# Altium project MINI-STM32.PRJPCB
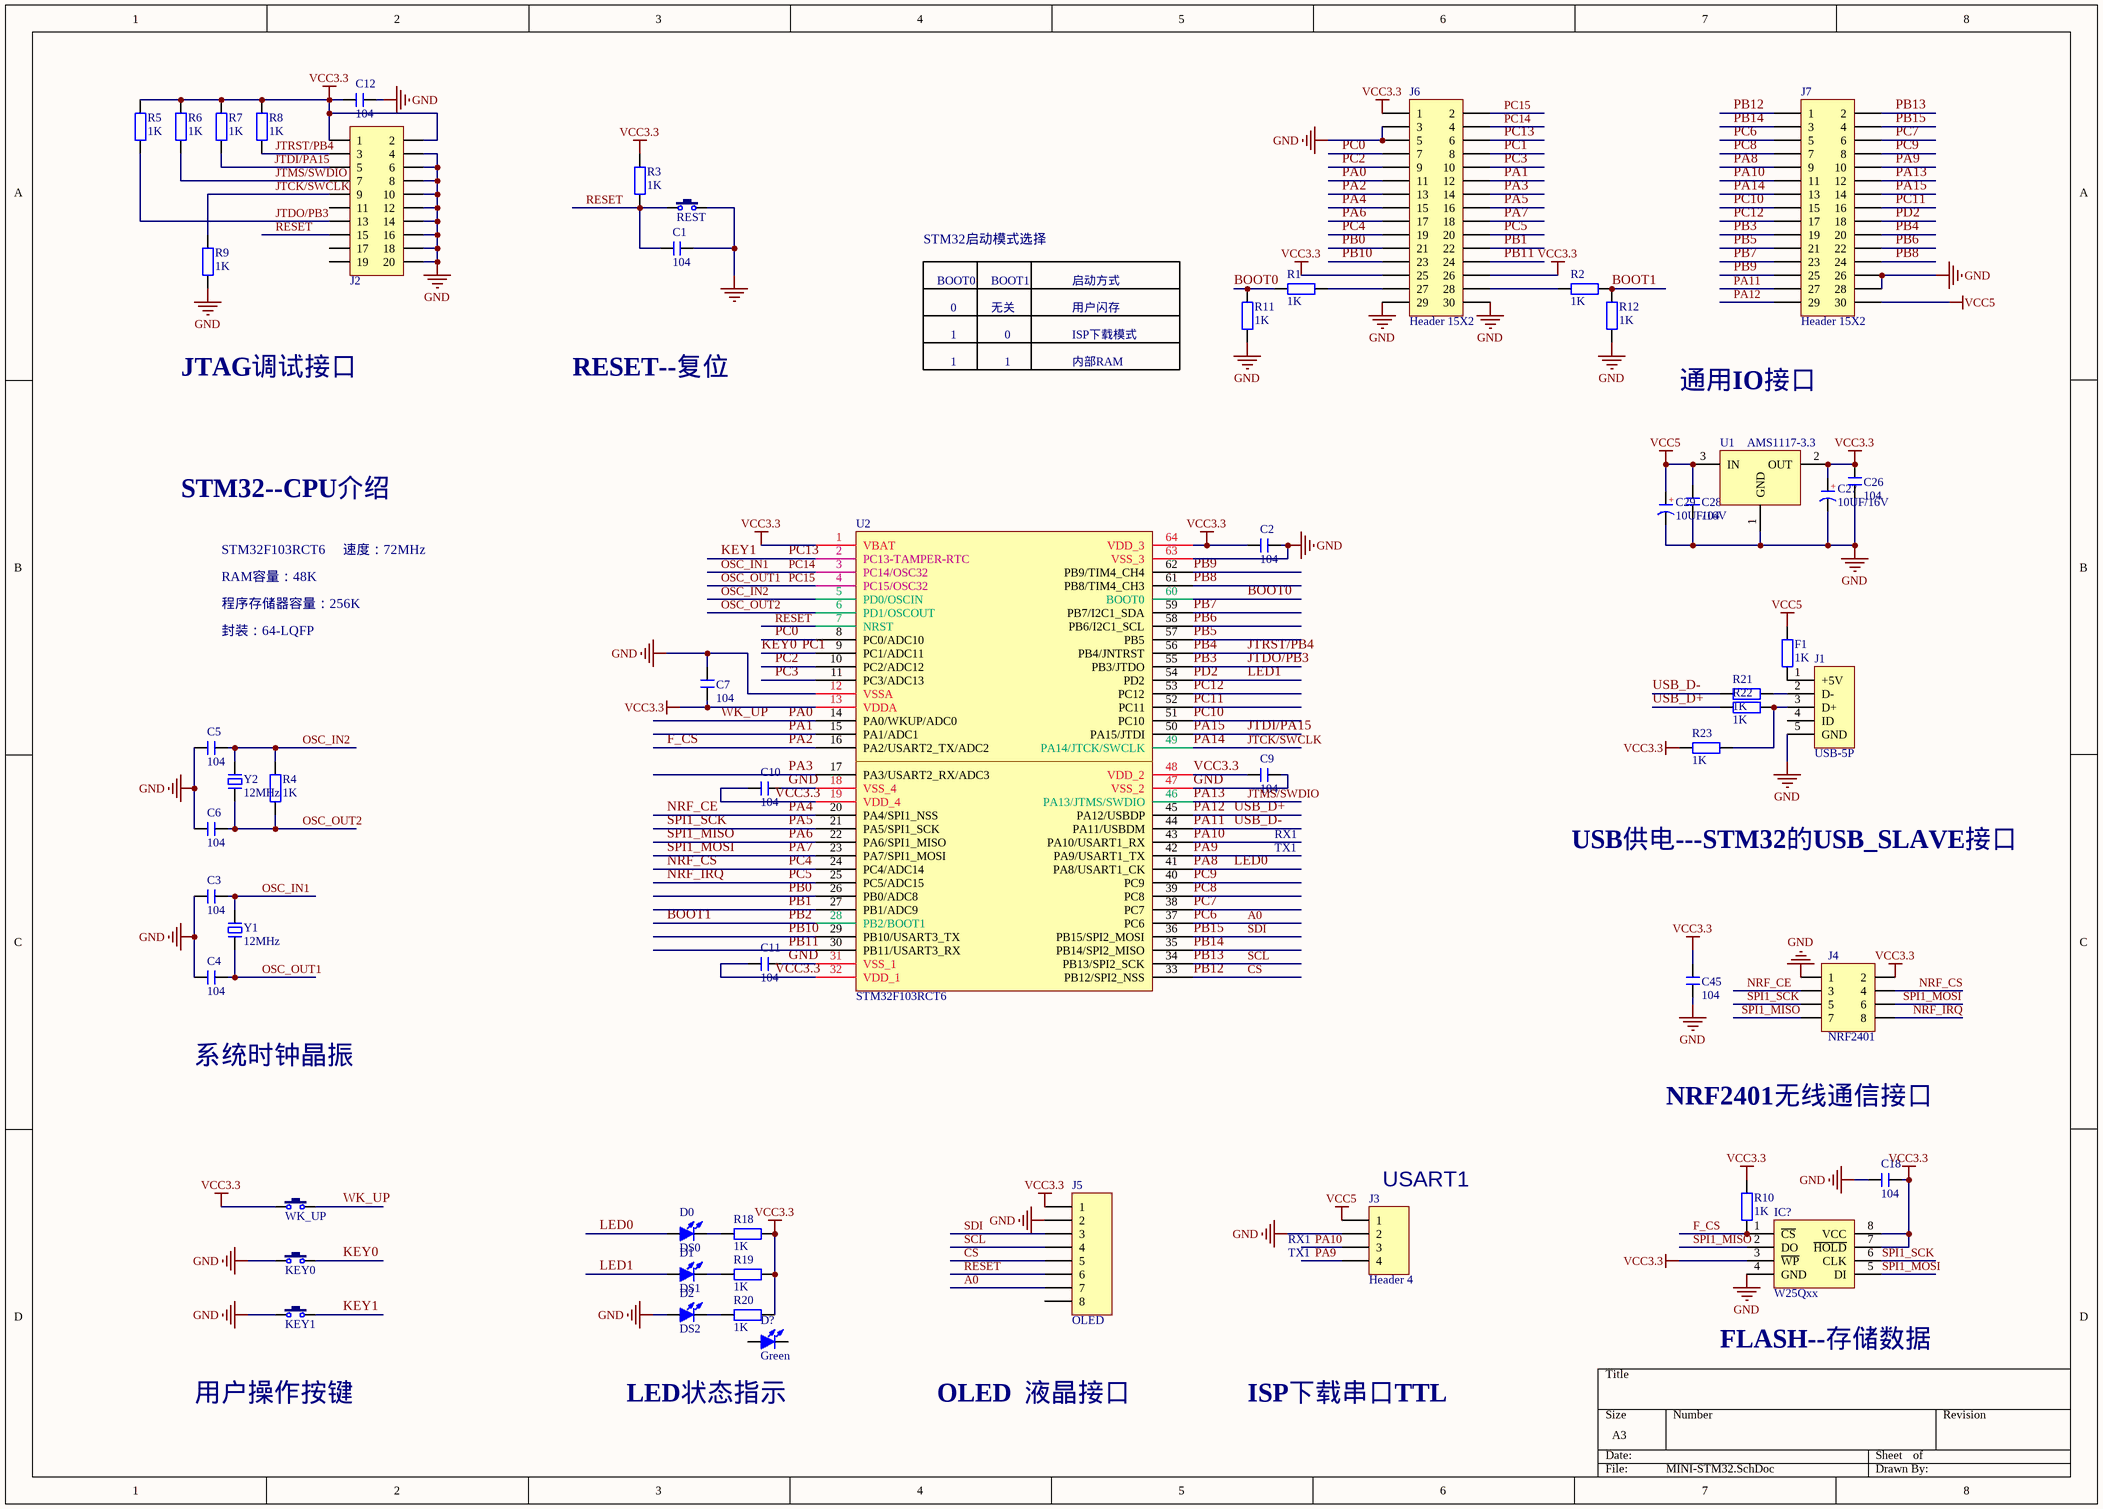
[diagram p0: MINI-STM32.SchDoc]
1 sheet, 56 parts. Net scope: global (net labels, ports and power ports of the same name join across sheets).
Board file: MINI-STM32.PcbDoc

## Sheet MINI-STM32.SchDoc
size A3

### Parts
C1  104  [C 0603]
C2  104  [C 0603]
C3  104  [C 0603]
C4  104  [C 0603]
C5  104  [C 0603]
C6  104  [C 0603]
C7  104  [C 0603]
C9  104  [C 0603]
C10  104  [C 0603]
C11  104  [C 0603]
C12  104  [C 0603]
C18  104  [C 0603]
C26  104  [C 0805]
C27  10UF/16V  [C 0805]
C28  104  [C 0603]
C29  10UF/16V  [C 0805]
C45  104  [C 0603]
D0  DS0  [LED 0805G]
D1  DS1  [LED 0805G]
D2  DS2  [LED 0805G]
D?  Green  [LED 0805G]
F1  1K  [R 0805]
IC?  W25Qxx  [SOP8W_N]
J1  USB-5P  [USB-MICRO_A]
J2  Header 2X10  [HDR-10X2]  (value not drawn)
J3  Header 4  [HDR-1X4]
J4  NRF2401  [HDR-4X2]
J5  OLED  [HDR-1X8_M]
J6  Header 15X2  [HDR-15X2]
J7  Header 15X2  [HDR-15X2]
KEY0  3x6x5  [TSW SMD-3*6*2.5]  (value not drawn)
KEY1  3x6x5  [TSW SMD-3*6*2.5]  (value not drawn)
R1  1K  [R 0603]
R2  1K  [R 0603]
R3  1K  [R 0603]
R4  1K  [R 0603]
R5  1K  [R 0603]
R6  1K  [R 0603]
R7  1K  [R 0603]
R8  1K  [R 0603]
R9  1K  [R 0603]
R10  1K  [R 0603]
R11  1K  [R 0603]
R12  1K  [R 0603]
R18  1K  [R 0603]
R19  1K  [R 0603]
R20  1K  [R 0603]
R21  1K  [R 0603]
R22  1K  [R 0603]
R23  1K  [R 0603]
REST  3x6x5  [TSW SMD-3*6*2.5]  (value not drawn)
U1  AMS1117-3.3  [SOT223_L]
U2  STM32F103RCT6  [LQFP64 7x7_L]
WK_UP  3x6x5  [TSW SMD-3*6*2.5]  (value not drawn)
Y1  12MHz  [XTAL-49S DIP]
Y2  12MHz  [XTAL-3X10]

### Nets
GND: C1.1 C2.2 C3.1 C4.1 C5.1 C6.1 C7.1 C9.2 C10.2 C11.2 C12.2 C18.1 C26.2 C27.2(K) C28.1 C29.2(K) C45.2 D2.1(A) IC?.4(GND) J1.5(GND) J2.4 J2.6 J2.8 J2.10 J2.12 J2.14 J2.16 J2.18 J2.20 J3.2 J4.1 J5.2 J6.3 J6.5 J6.29 J6.30 J7.26 J7.28 KEY0.1 KEY1.1 R9.1 R11.2 R12.2 REST.2 U1.1(GND) U2.12(VSSA) U2.18(VSS_4) U2.31(VSS_1) U2.47(VSS_2) U2.63(VSS_3)
VCC3.3: C2.1 C7.2 C9.1 C10.1 C11.1 C12.1 C18.2 C26.1 C27.1(A) C45.1 IC?.3(~{WP}) IC?.7(~{HOLD}) IC?.8(VCC) J2.1 J2.2 J4.2 J5.1 J6.1 J6.25 J6.26 R3.2 R5.2 R6.2 R7.2 R8.2 R10.1 R18.1 R19.1 R20.1 R23.2 U1.2(OUT) U2.1(VBAT) U2.13(VDDA) U2.19(VDD_4) U2.32(VDD_1) U2.48(VDD_2) U2.64(VDD_3) WK_UP.1
VCC5: C28.2 C29.1(A) F1.1 J3.1 J7.30 U1.3(IN)
A0: J5.7 J7.5 U2.37(PC6)  [also labelled PC6]
BOOT0: R1.2 R11.1 U2.60(BOOT0)
BOOT1: R2.1 R12.1 U2.28(PB2/BOOT1)  [also labelled PB2]
CS: J5.5 J7.1 U2.33(PB12/SPI2_NSS)  [also labelled PB12]
F_CS: IC?.1(~{CS}) J6.13 R10.2 U2.16(PA2/USART2_TX/ADC2)  [also labelled PA2]
JTCK/SWCLK: J2.9 J7.13 R9.2 U2.49(PA14/JTCK/SWCLK)  [also labelled PA14]
JTDI/PA15: J2.5 J7.14 R7.1 U2.50(PA15/JTDI)  [also labelled PA15]
JTDO/PB3: J2.13 J7.19 R5.1 U2.55(PB3/JTDO)  [also labelled PB3]
JTMS/SWDIO: J2.7 J7.12 R6.1 U2.46(PA13/JTMS/SWDIO)  [also labelled PA13]
JTRST/PB4: J2.3 J7.20 R8.1 U2.56(PB4/JNTRST)  [also labelled PB4]
KEY0: J6.8 KEY0.2 U2.9(PC1/ADC11)  [also labelled PC1]
KEY1: J6.6 KEY1.2 U2.2(PC13-TAMPER-RTC)  [also labelled PC13]
LED0: D0.1(A) J7.9 U2.41(PA8/USART1_CK)  [also labelled PA8]
LED1: D1.1(A) J7.18 U2.54(PD2)  [also labelled PD2]
NRF_CE: J4.3 J6.15 U2.20(PA4/SPI1_NSS)  [also labelled PA4]
NRF_CS: J4.4 J6.19 U2.24(PC4/ADC14)  [also labelled PC4]
NRF_IRQ: J4.8 J6.20 U2.25(PC5/ADC15)  [also labelled PC5]
OSC_IN1: C3.2 J6.4 U2.3(PC14/OSC32) Y1.2  [also labelled PC14]
OSC_IN2: C5.2 R4.2 U2.5(PD0/OSCIN) Y2.1
OSC_OUT1: C4.2 J6.2 U2.4(PC15/OSC32) Y1.1  [also labelled PC15]
OSC_OUT2: C6.2 R4.1 U2.6(PD1/OSCOUT) Y2.2
PA0: J6.11 U2.14(PA0/WKUP/ADC0) WK_UP.2  [also labelled WK_UP]
PA1: J6.12 U2.15(PA1/ADC1)
PA3: J6.14 U2.17(PA3/USART2_RX/ADC3)
PA5: IC?.6(CLK) J4.5 J6.16 U2.21(PA5/SPI1_SCK)  [also labelled SPI1_SCK]
PA6: IC?.2(DO) J4.7 J6.17 U2.22(PA6/SPI1_MISO)  [also labelled SPI1_MISO]
PA7: IC?.5(DI) J4.6 J6.18 U2.23(PA7/SPI1_MOSI)  [also labelled SPI1_MOSI]
PA9: J3.4 J7.10 U2.42(PA9/USART1_TX)
PA10: J3.3 J7.11 U2.43(PA10/USART1_RX)
PA11: J7.27 R21.2 U2.44(PA11/USBDM)  [also labelled USB_D-]
PA12: J7.29 R22.2 U2.45(PA12/USBDP)  [also labelled USB_D+]
PB0: J6.21 U2.26(PB0/ADC8)
PB1: J6.22 U2.27(PB1/ADC9)
PB5: J7.21 U2.57(PB5)
PB6: J7.22 U2.58(PB6/I2C1_SCL)
PB7: J7.23 U2.59(PB7/I2C1_SDA)
PB8: J7.24 U2.61(PB8/TIM4_CH3)
PB9: J7.25 U2.62(PB9/TIM4_CH4)
PB10: J6.23 U2.29(PB10/USART3_TX)
PB11: J6.24 U2.30(PB11/USART3_RX)
PB13: J5.4 J7.2 U2.34(PB13/SPI2_SCK)  [also labelled SCL]
PB14: J7.3 U2.35(PB14/SPI2_MISO)
PB15: J5.3 J7.4 U2.36(PB15/SPI2_MOSI)  [also labelled SDI]
PC0: J6.7 U2.8(PC0/ADC10)
PC2: J6.9 U2.10(PC2/ADC12)
PC3: J6.10 U2.11(PC3/ADC13)
PC7: J7.6 U2.38(PC7)
PC8: J7.7 U2.39(PC8)
PC9: J7.8 U2.40(PC9)
PC10: J7.15 U2.51(PC10)
PC11: J7.16 U2.52(PC11)
PC12: J7.17 U2.53(PC12)
RESET: C1.2 J2.15 J5.6 R3.1 REST.1 U2.7(NRST)
NetD0_2: D0.2(K) R18.2
NetD1_2: D1.2(K) R19.2
NetD2_2: D2.2(K) R20.2
NetF1_2: F1.2 J1.1(+5V)
NetJ1_2: J1.2(D-) R21.1
NetJ1_3: J1.3(D+) R22.1 R23.1
NetJ6_27: J6.27 R1.1
NetJ6_28: J6.28 R2.2

Not connected (* = marked no-connect by the designer): D? 1(A) 2(K); J1 4(ID); J2 11 17 19; J5 8

### Notes on the sheet
- STM32启动模式选择
- BOOT0
- 0
- BOOT1
- 无关
- 启动方式
- 用户闪存
- JTAG调试接口
- RESET--复位
- 1
- ISP下载模式
- 内部RAM
- 通用IO接口
- STM32--CPU介绍
- STM32F103RCT6
- RAM容量：48K
- 速度：72MHz
- 程序存储器容量：256K
- 封装：64-LQFP
- RX1
- TX1
- USB供电---STM32的USB_SLAVE接口
- 系统时钟晶振
- NRF2401无线通信接口
- (near J3) USART1
- (near IC?) FLASH--存储数据
- 用户操作按键
- LED状态指示
- OLED  液晶接口
- ISP下载串口TTL
- (in symbol C-CAP) +

### Library data of the parts
C1-C7 C9-C12 C18 C26 C28 C45 = C: 无极性贴片电容; 版权归属: 源创客; BOM名称: 无极性贴片电容; 学习资源: www.ooocke.com
C27 C29 = C-CAP: 直插电解电容; 版权归属: 源创客; BOM名称: 直插电解电容; 学习资源: www.ooocke.com
D0-D2 D? = LED-SMD: 贴片LED; 版权归属: 源创客; BOM名称: 贴片LED; 学习资源: www.ooocke.com
F1 R1-R12 R18-R23 = R: 贴片电阻; 版权归属: 源创客; BOM名称: 贴片电阻; 学习资源: www.ooocke.com
IC? = W25Qxx: 外置Flash; 版权归属: 源创客; BOM名称: 外置Flash; 学习资源: www.ooocke.com
J1 = USB-5P: 微型USB母座; 版权归属: 源创客; BOM名称: 微型USB母座; 学习资源: www.ooocke.com
J2 = Header 10X2: 10*2P接插件; 版权归属: 源创客; BOM名称: 10*2P接插件; 学习资源: www.ooocke.com
J3 = Header 4: Header, 4-Pin; LatestRevisionDate: 17-Jul-2002; LatestRevisionNote: Re-released for DXP Platform.; Publisher: Altium Limited
J4 = Header 4X2: 4*2P接插件; 版权归属: 源创客; BOM名称: 4*2P接插件; 学习资源: www.ooocke.com
J5 = Header 8: Header, 8-Pin
J6 J7 = Header 15X2: Header, 15-Pin, Dual row; LatestRevisionDate: 17-Jul-2002; LatestRevisionNote: Re-released for DXP Platform.; Publisher: Altium Limited
KEY0 KEY1 REST WK_UP = TSW 3x6: 3x6轻触开关; 版权归属: 源创客; BOM名称: 3x6轻触开关; 学习资源: www.ooocke.com
U1 = LT1085CM-3.3
U2 = STM32F103RBT6
Y1 Y2 = XTAL-2: 2脚晶振; 版权归属: 源创客; BOM名称: 2脚晶振; 学习资源: www.ooocke.com